# EAGLE schematic XMICRO Bus Pinout (EAGLE 6.3)
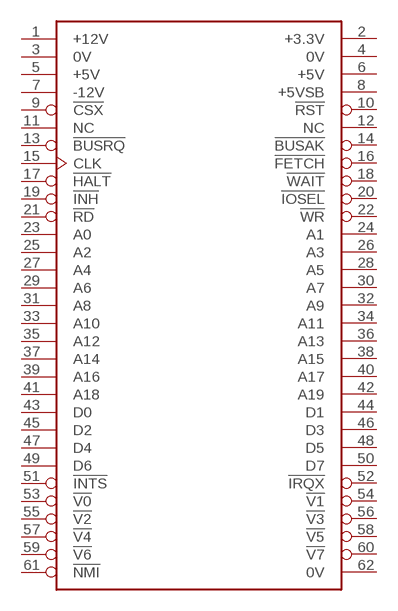
[diagram p0: schematic, sheet 1]

## Parts
U$1  XMICRO-BUS-PHYSICAL-EDGE62F  [EDGE62F]
Unconnected: U$1.1(+12V) U$1.2(+3.3V) U$1.3(0V) U$1.4(0V) U$1.5(+5V) U$1.6(+5V) U$1.7(-12V) U$1.8(+5VSB) U$1.9(!CSX) U$1.10(!RST) U$1.11(NC) U$1.12(NC) U$1.13(!BUSRQ) U$1.14(!BUSAK) U$1.15(CLK) U$1.16(!FETCH) U$1.17(!HALT) U$1.18(!WAIT) U$1.19(!INH) U$1.20(!IOSEL) U$1.21(!RD) U$1.22(!WR) U$1.23(A0) U$1.24(A1) U$1.25(A2) U$1.26(A3) U$1.27(A4) U$1.28(A5) U$1.29(A6) U$1.30(A7) U$1.31(A8) U$1.32(A9) U$1.33(A10) U$1.34(A11) U$1.35(A12) U$1.36(A13) U$1.37(A14) U$1.38(A15) U$1.39(A16) U$1.40(A17) U$1.41(A18) U$1.42(A19) U$1.43(D0) U$1.44(D1) U$1.45(D2) U$1.46(D3) U$1.47(D4) U$1.48(D5) U$1.49(D6) U$1.50(D7) U$1.51(!INTS) U$1.52(!IRQX) U$1.53(!V0) U$1.54(!V1) U$1.55(!V2) U$1.56(!V3) U$1.57(!V4) U$1.58(!V5) U$1.59(!V6) U$1.60(!V7) U$1.61(!NMI) U$1.62(0V)

## Library data of the parts
U$1 = Custom:XMICRO-BUS-PHYSICAL